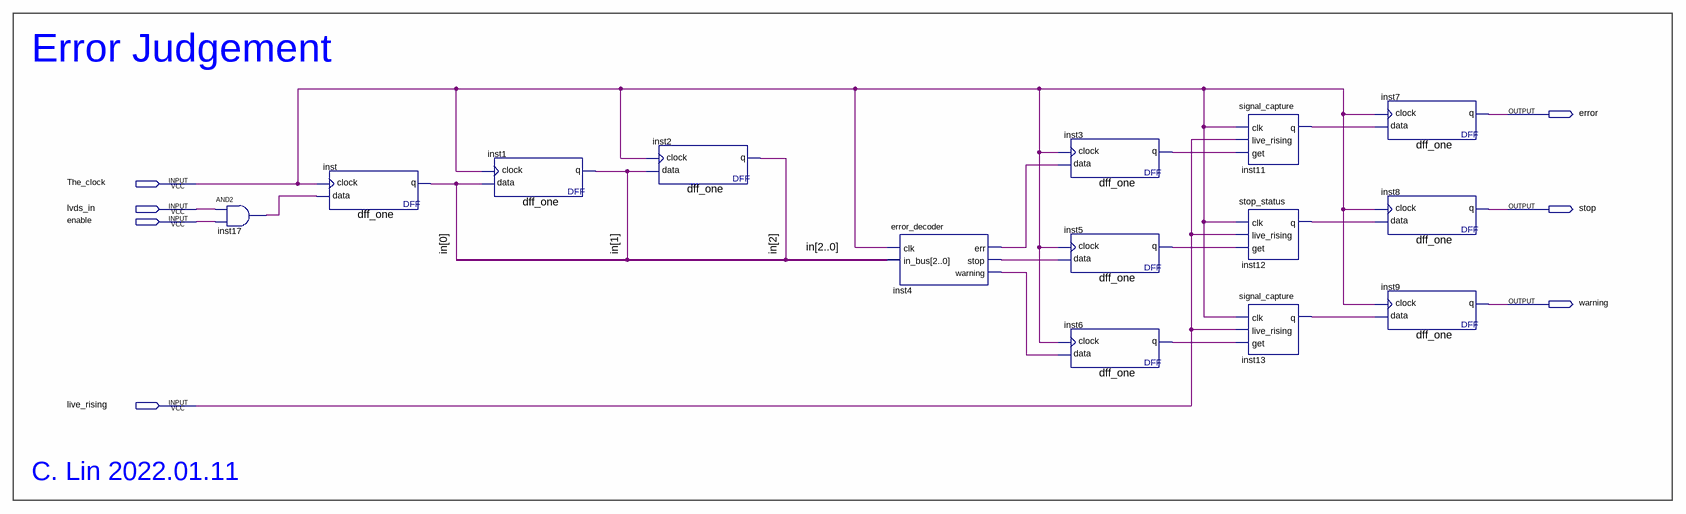
[diagram p0: schematic sheet]
// Quartus schematic error_judgement.bdf as structural Verilog: 14 symbols, 7 pins
module error_judgement (
  input  The_clock,
  input  lvds_in,
  input  enable,
  input  live_rising,
  output error,
  output stop,
  output warning
);

  wire inst3_q, inst4_err, inst4_stop, inst4_warning, inst5_q, inst6_q, inst11_q, inst12_q, inst13_q,
       inst17_out;
  wire [2:0] in;

  and inst17 (inst17_out, lvds_in, enable);
  dff_one inst (.data(inst17_out), .clock(The_clock), .q(in[0]));
  dff_one inst1 (.data(in[0]), .clock(The_clock), .q(in[1]));
  dff_one inst2 (.data(in[1]), .clock(The_clock), .q(in[2]));
  error_decoder inst4 (.clk(The_clock), .in_bus(in), .err(inst4_err), .stop(inst4_stop), .warning(inst4_warning));
  dff_one inst3 (.data(inst4_err), .clock(The_clock), .q(inst3_q));
  dff_one inst5 (.data(inst4_stop), .clock(The_clock), .q(inst5_q));
  dff_one inst6 (.data(inst4_warning), .clock(The_clock), .q(inst6_q));
  signal_capture inst11 (.clk(The_clock), .live_rising(live_rising), .get(inst3_q), .q(inst11_q));
  stop_status inst12 (.clk(The_clock), .live_rising(live_rising), .get(inst5_q), .q(inst12_q));
  signal_capture inst13 (.clk(The_clock), .live_rising(live_rising), .get(inst6_q), .q(inst13_q));
  dff_one inst7 (.data(inst11_q), .clock(The_clock), .q(error));
  dff_one inst8 (.data(inst12_q), .clock(The_clock), .q(stop));
  dff_one inst9 (.data(inst13_q), .clock(The_clock), .q(warning));

  // Notes on the sheet:
  //   Error Judgement
  //   C. Lin 2022.01.11
endmodule
